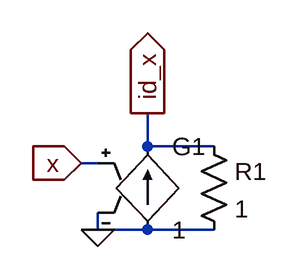
[diagram p0: schematic id.asc]
id.asc, the LTspice schematic file:
Version 4
SHEET 1 880 680
WIRE 192 112 192 80
WIRE 256 112 192 112
WIRE 144 128 128 128
WIRE 144 192 144 176
WIRE 192 192 144 192
WIRE 256 192 192 192
FLAG 128 128 x
IOPIN 128 128 In
FLAG 144 192 0
FLAG 192 80 id_x
IOPIN 192 80 Out
SYMBOL g 192 96 R0
SYMATTR InstName G1
SYMATTR Value 1
SYMBOL res 240 96 R0
SYMATTR InstName R1
SYMATTR Value 1

The netlist it stands for:
* id.asc
G1 0 id_x x 0 1
R1 id_x 0 1
.backanno
.end